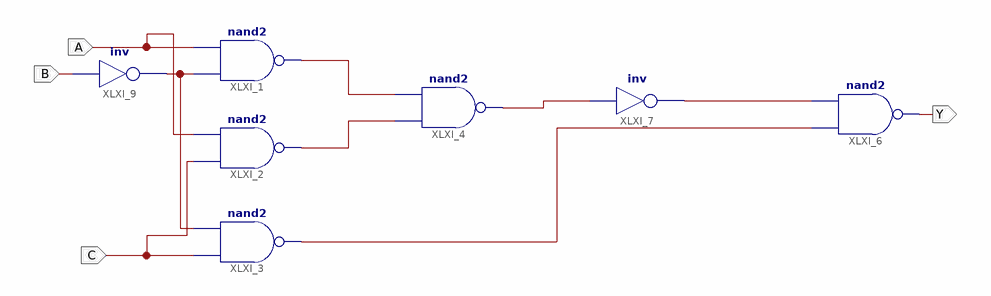
[diagram p0: schematic sheet 1]
// Xilinx ISE schematic Lab_B_Schematic.sch (artix7) as structural Verilog: 7 symbols, 4 ports
module Lab_B_Schematic (
  input  A,
  input  B,
  input  C,
  output Y
);

  wire XLXN_10, XLXN_13, XLXN_14, XLXN_15, XLXN_16, XLXN_17;

  nand XLXI_1 (XLXN_13, XLXN_10, A);
  nand XLXI_2 (XLXN_14, C, A);
  nand XLXI_3 (XLXN_17, C, XLXN_10);
  nand XLXI_4 (XLXN_15, XLXN_14, XLXN_13);
  nand XLXI_6 (Y, XLXN_17, XLXN_16);
  not XLXI_7 (XLXN_16, XLXN_15);
  not XLXI_9 (XLXN_10, B);
endmodule
